# Altium schematic sheet RELE_LEVEL.SchDoc
size 199 x 199 mm; SheetNumber: 3; SheetTotal: 6
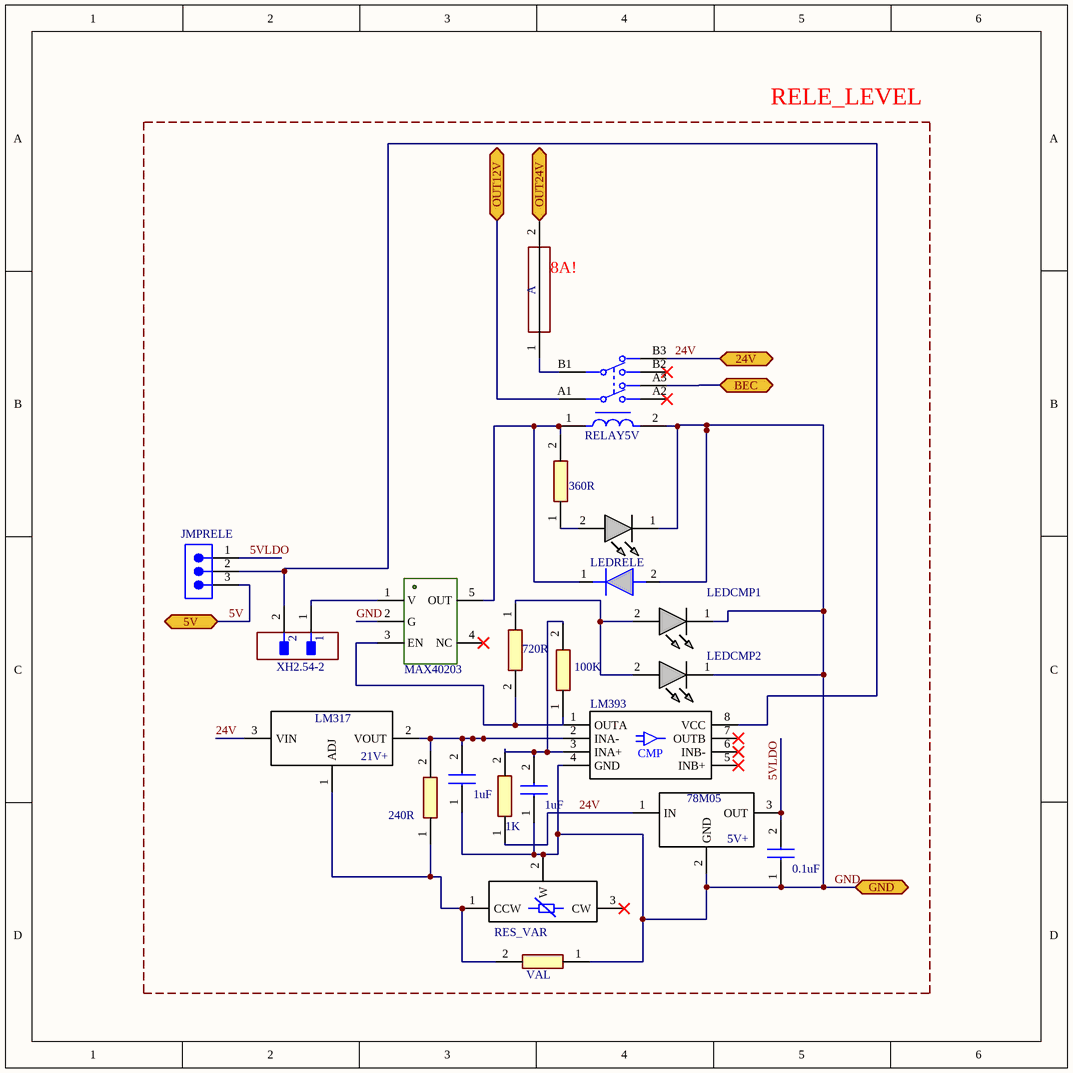
[diagram p0: RELE_LEVEL.SchDoc]

## Parts
ANCOM1  MAX40203  [MAX40203]
CAPCMP  1uF  [К10-17Б]
CAPGIS  1uF  [К10-17Б]
CAPREG  0.1uF  [К10-17Б]
CMP  LM393  [LM393ADR]
CMPLOOP  100K  [RES0805]
DIODRELE  DIOD0805  [DIOD0805]  (value not drawn)
FUSE24V  8A!  [Fuse]
JMPRELE  JMP-03P  [JMP-03P]  (value not drawn)
LEDCMP1  LED0805  [LED0805]  (value not drawn)
LEDCMP2  LED0805  [LED0805]  (value not drawn)
LEDRELE  GREEN  [LED0805]  (value not drawn)
RCMP1  240R  [RES0805]
RCMP2  RES_VAR  [3296W]
RCMP?  1K  [RES0805]
RELAY  RELAY5V  [RELAY-5V]
RESCMP  720R  [RES0805]
RESRELE  360R  [RES0805]
RVAR  VAL  [RES0805]
VREF1  LM317  [LM317]  (value not drawn)
VREF2  78M05  [78M05]  (value not drawn)
XHRELE  XH2.54-2  [XH2.54-2]

## Blocks framed on the sheet
RELE_LEVEL: ANCOM1 CAPCMP CAPGIS CAPREG CMP CMPLOOP DIODRELE FUSE24V JMPRELE LEDCMP1 LEDCMP2 LEDRELE RCMP1 RCMP2 RCMP? RELAY RESCMP RESRELE RVAR VREF1 VREF2 XHRELE

## Ports
5V (bidir), 24V (bidir), BEC (bidir), GND (bidir), OUT12V (bidir), OUT24V (bidir)

## Nets
5V: JMPRELE.3 ; port 5V
5VLDO: CAPREG.2 JMPRELE.1 VREF2.3(OUT)
24V: RCMP?.1 RELAY.B3 VREF1.3(VIN) VREF2.1(IN) ; port 24V
BEC: RELAY.A3 ; port BEC
GND: ANCOM1.2(G) CAPCMP.1 CAPGIS.1 CAPREG.1 CMP.4(GND) DIODRELE.2(A) LEDCMP1.1(K) LEDCMP2.1(K) LEDRELE.1(K) RCMP2.2(W) RELAY.2(A2) RVAR.1 VREF2.2(GND) ; port GND
OUT12V: RELAY.A1 ; port OUT12V
OUT24V: FUSE24V.2 ; port OUT24V
NetANCOM1_1: ANCOM1.1(V) XHRELE.1
NetANCOM1_3: ANCOM1.3(EN) CMP.1(OUTA) CMPLOOP.1 RESCMP.2
NetANCOM1_5: ANCOM1.5(OUT) DIODRELE.1(K) RELAY.1(A1) RESRELE.2
NetCAPCMP_2: CAPCMP.2 CMP.2(INA-) RCMP1.2 VREF1.2(VOUT)
NetCAPGIS_2: CAPGIS.2 CMP.3(INA+) CMPLOOP.2 RCMP?.2
NetCMP_8: CMP.8(VCC) JMPRELE.2 XHRELE.2
NetFUSE24V_1: FUSE24V.1 RELAY.B1
NetLEDCMP1_2: LEDCMP1.2(A) LEDCMP2.2(A) RESCMP.1
NetLEDRELE_2: LEDRELE.2(A) RESRELE.1
NetRCMP1_1: RCMP1.1 RCMP2.1(CCW) RVAR.2 VREF1.1(ADJ)

Not connected (* = marked no-connect by the designer): ANCOM1 4(NC)*; CMP 5(INB+)* 6(INB-)* 7(OUTB)*; RCMP2 3(CW)*; RELAY A2(14)* B2(24)*

## Notes on the sheet
- (in symbol 78M05) 5V+
- (in symbol Fuse) A
- (in symbol LM317) 21V+

## Library data of the parts
ANCOM1 = MAX40203: MAX40203AUK+T
CAPCMP CAPGIS CAPREG = CAP: К10-17Б
CMP = LM393: LM393ADR
CMPLOOP RCMP1 RCMP? RESCMP RESRELE RVAR = RES0805: RES-SMD0805
DIODRELE = DIOD0805: 1N4448WS-7-F
FUSE24V = Fuse: KLS5-242 & BLX-A & BF-013
JMPRELE = JMP-03P: PLS-1x3
LEDCMP1 LEDCMP2 LEDRELE = LED0805: LED-SMD0805
RCMP2 = RES_VAR: 3296W
RELAY = RELAY-5V: R2G2CH005
VREF1 = LM317: LM317AEMP
VREF2 = 78M05: 78M05 +5V
XHRELE = XH2.54-2: JST XH2.54-2pin